# EAGLE design smps v.1.1 (EAGLE 7.3.0)
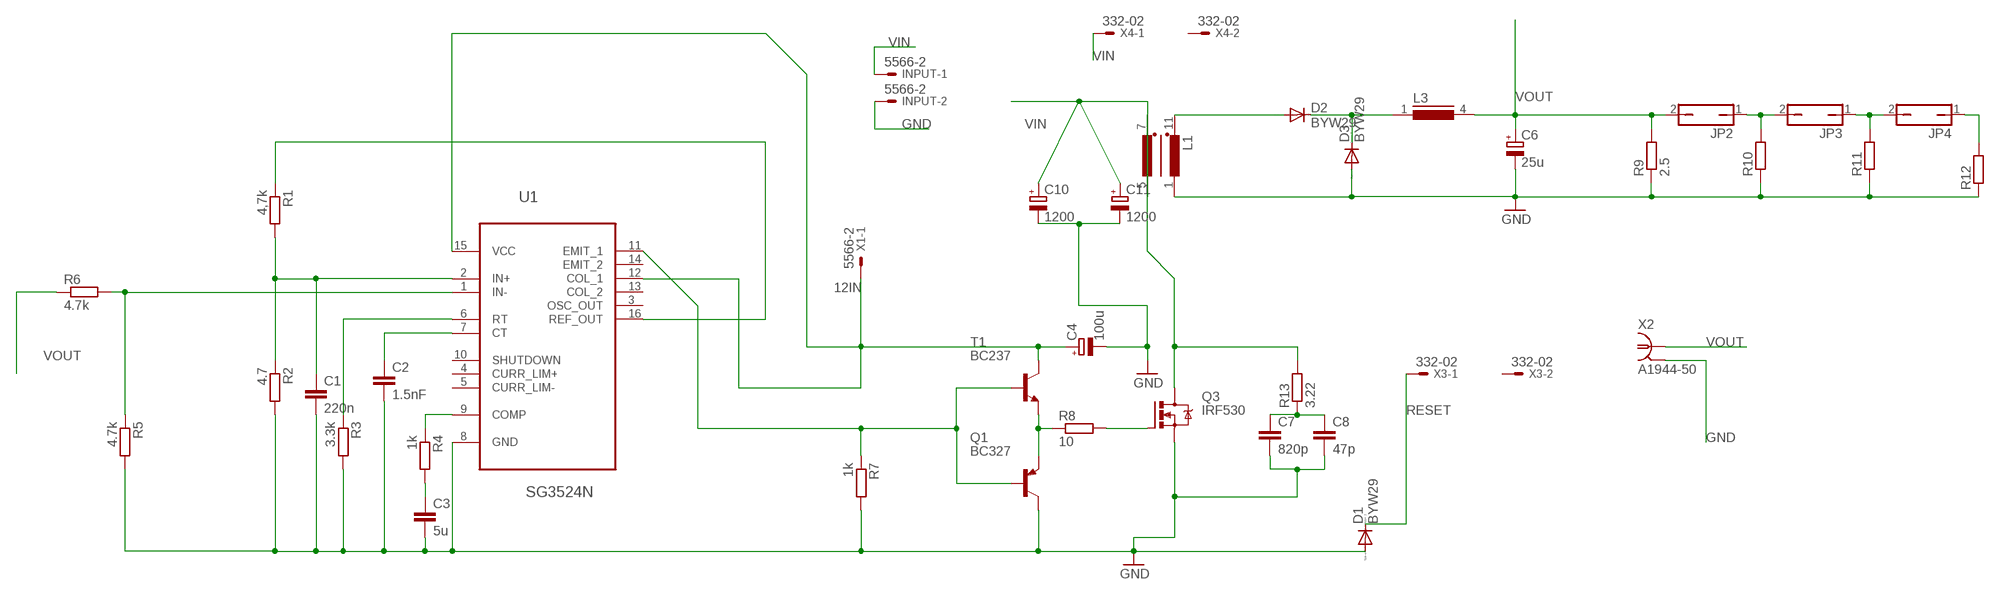
[diagram p0: schematic, sheet 1]

## Parts
C1  220n  C-EU050-030X075  [C050-030X075]
C2  1.5nF  C-EU050-035X075  [C050-035X075]
C3  5u  C-EU050-035X075  [C050-035X075]
C4  100u  CPOL-EUE2-4  [E2-4]
C6  25u  CPOL-EUE2-4  [E2-4]
C7  820p  C-EU025-025X050  [C025-025X050]
C8  47p  C-EU025-025X050  [C025-025X050]
C10  1200  CPOL-EUE7.5-16  [E7,5-16]
C11  1200  CPOL-EUE7.5-16  [E7,5-16]
D1  BYW29  [DO220S]
D2  BYW29  [DO220S]
D3  BYW29  [DO220S]
INPUT  5566-2  [5566-2]
JP2  JP1Q  [JP1]
JP3  JP1Q  [JP1]
JP4  JP1Q  [JP1]
L1  RM6-2RM812  [RM8-12]
L3  RM6NEWVARIANT  [RM7-8]
Q1  BC327  [TO92]
Q3  IRF530  [TO220BV]
R1  4,7k  R-EU_0204/7  [0204/7]
R2  4.7  R-EU_0204/7  [0204/7]
R3  3.3k  R-EU_0204/7  [0204/7]
R4  1k  R-EU_0204/7  [0204/7]
R5  4.7k  R-EU_0204/7  [0204/7]
R6  4.7k  R-EU_0204/7  [0204/7]
R7  1k  R-EU_0204/7  [0204/7]
R8  10  R-EU_0204/7  [0204/7]
R9  2.5  R-EU_0617/5V  [0617V]
R10  R-EU_0617/5V  [0617V]
R11  R-EU_0617/5V  [0617V]
R12  R-EU_0617/5V  [0617V]
R13  3.22  R-EU_0204/2V  [0204V]
T1  BC237  [TO92]
U1  SG3524N  [DIP254P762X508-16]
X1  5566-2  [5566-2]
X2  A1944-50  [A1944]
X3  332-02  [332-02]
X4  332-02  [332-02]

## Nets
12IN: C4.+ T1.3(C) U1.12(COL_1) U1.15(VCC) X1.1
GND: C1.2 C2.2 C3.2 C4.- C6.- C7.2 C8.2 C10.- C11.- D1.A D3.A INPUT.2 L1.1(W1E) Q1.3(C) Q3.S R2.2 R3.2 R5.2 R7.2 R9.1 R10.1 R11.1 R12.1 U1.8(GND) X2.2 X2.3 X2.4 X2.5
N$1: R1.1 U1.16(REF_OUT)
N$2: C1.1 R1.2 R2.1 U1.2(IN+)
N$3: Q1.2(B) R7.1 T1.2(B) U1.11(EMIT_1)
N$5: R3.1 U1.6(RT)
N$6: C2.1 U1.7(CT)
N$7: R4.1 U1.9(COMP)
N$8: C3.1 R4.2
N$9: R5.1 R6.2 U1.1(IN-)
N$10: Q1.1(E) R8.1 T1.1(E)
N$11: D2.A L1.11(W1A)
N$12: Q3.G R8.2
N$13: D2.C D3.C L3.1
N$14: L1.7(W2A) Q3.D R13.2
N$15: JP2.1 JP3.2 R10.2
N$16: JP3.1 JP4.2 R11.2
N$17: JP4.1 R12.2
N$18: C7.1 C8.1 R13.1
RESET: D1.C X3.1
VIN: C10.+ C11.+ INPUT.1 L1.5(W2E) X4.1
VOUT: C6.+ JP2.2 L3.4 R6.1 R9.2 X2.1
Unconnected: U1.3(OSC_OUT) U1.4(CURR_LIM+) U1.5(CURR_LIM-) U1.10(SHUTDOWN) U1.13(COL_2) U1.14(EMIT_2) X1.2 X3.2 X4.2

## Library data of the parts
C1 = resistor:C-EU: CAPACITOR, European symbol
C2 C3 C7 C8 = rcl:C-EU: CAPACITOR, European symbol
C4 C6 C10 C11 = rcl:CPOL-EU: POLARIZED CAPACITOR, European symbol
D1-D3 = diode:BYW29: DIODE ultra fast rectifier, 200 V, 8 A
INPUT X1 = con-molex:5566-2: Mini FIT connector 2 pol Source: http://www.molex.com; OC_FARNELL: 1822072; OC_NEWARK: unknown
JP2-JP4 = jumper:JP1Q: JUMPER
L1 = trafo-siemens:RM6-2: TRANSFORMER
L3 = trafo-siemens:RM6: INDUCTOR
Q1 = transistor-pnp:BC327: PNP Transistor
Q3 = transistor-power:IRF530: HEXFET Power MOSFET
R1-R8 = resistor:R-EU_: RESISTOR, European symbol
R9-R13 = rcl:R-EU_: RESISTOR, European symbol
T1 = transistor:BC237: NPN TRANSISTOR
U1 = Texas Instruments_By_element14_Batch_1:SG3524N: REGULATING PULSE-WIDTH-MODULATORS; MPN: SG3524N; OC_FARNELL: 1094322; OC_NEWARK: 60K6778; PACKAGE: PDIP-16; SUPPLIER: Texas Instruments
X2 = con-coax:A1944-50: BNC CONNECTOR 50 Ohm distributor Buerklin 78F2475; OC_FARNELL: unknown; OC_NEWARK: unknown
X3 X4 = con-garry:332-02: 2 Pin - 2mm Dual Row Source: www.mpe-connector.de / garry_shortform_2012.pdf

## Board
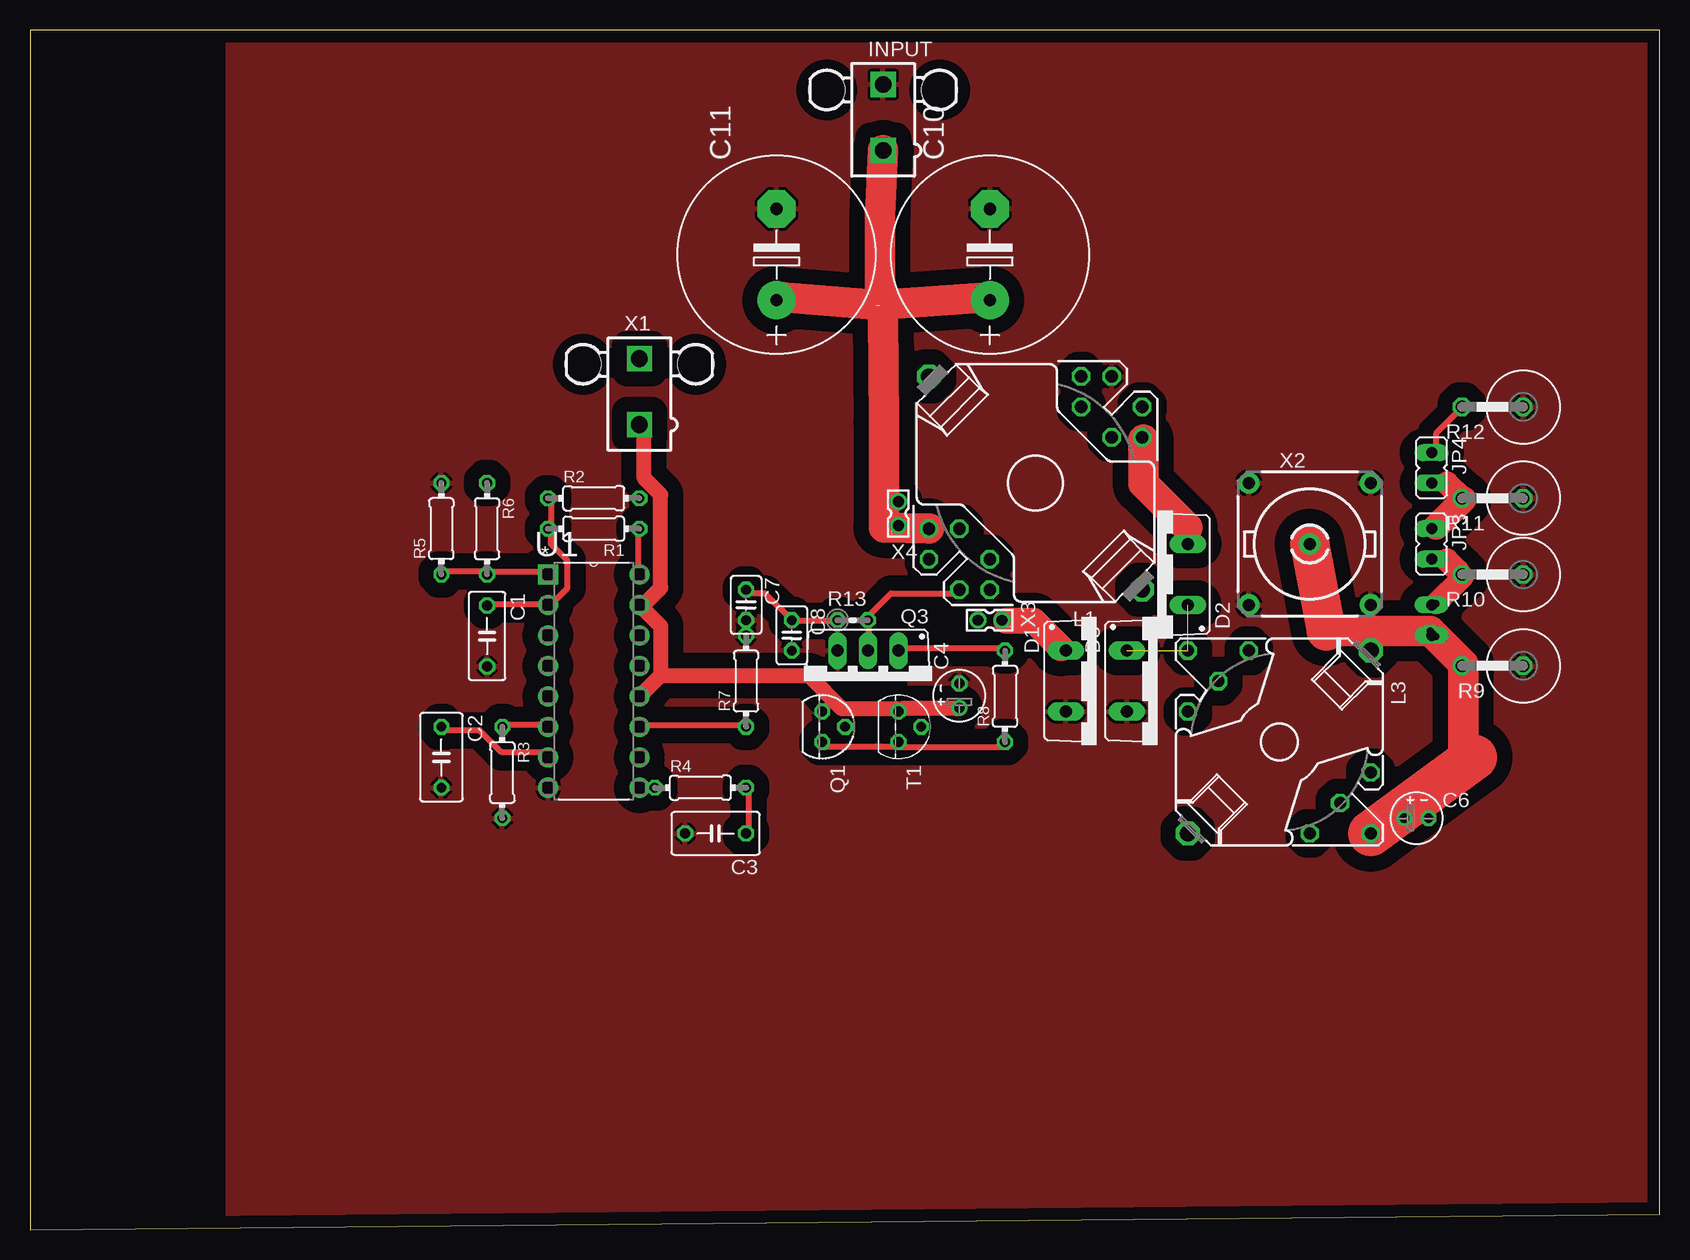
[diagram p1: board, top side]
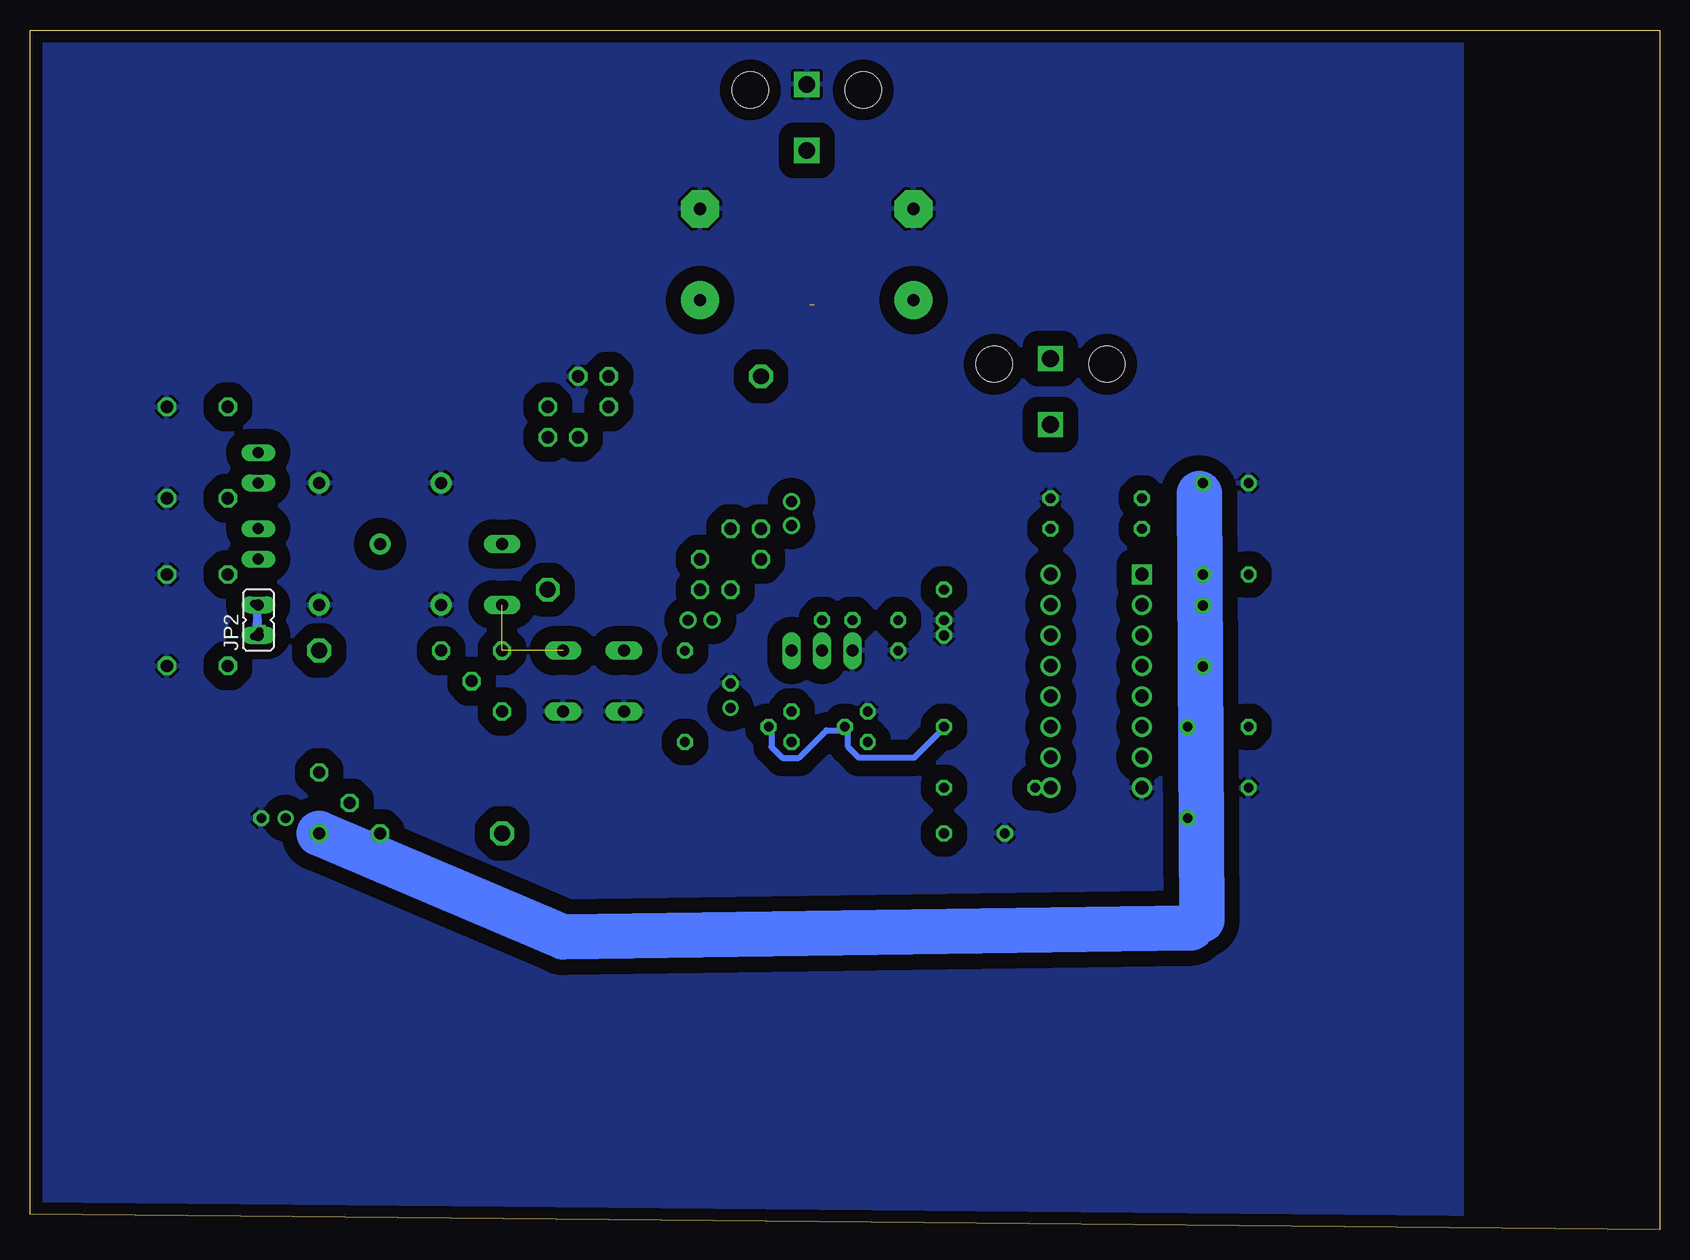
[diagram p2: board, bottom side, seen from below]

Size 135.87 x 100 mm. Coordinates in mm from the lower left corner, seen from the top.
Outline: 0,0 135.87,1.27 135.87,100 0,100 0,0
Copper layers (1*16): Top 0.035mm / dielectric 1.5mm / Bottom 0.035mm
Design rules "default *": minimum track width 20mil, minimum drill 24mil, track to track 50mil, track to pad 50mil, pad to pad 50mil, via to via 50mil, smd to smd 8mil, copper to edge 40mil, drill to drill 8mil, minimum pad ring 10mil, minimum via ring 8mil, stop-mask expansion 4mil, vias tented up to drill 0mil, thermal gap 10mil

### Footprints (pad centres in the part's own frame; a part is rotated, then mirrored left to right if it is on the bottom)
C050-030X075 = drill 0.813 octagon: 1 -2.54,0; 2 2.54,0
C050-035X075 = drill 0.813 octagon: 1 -2.54,0; 2 2.54,0
E2-4 = drill 0.813 pad 1.27: + -1.016,0 | drill 0.813 pad 1.27 octagon: - 1.016,0
C025-025X050 = drill 0.813 octagon: 1 -1.27,0; 2 1.27,0
E7,5-16 = drill 1.016 pad 3.15: + -3.81,0 | drill 1.016 pad 3.15 octagon: - 3.81,0
DO220S = drill 1.016 long: A 2.54,-2.54; C -2.54,-2.54
5566-2 = drill 1.4 square: 1 0,-2.75; 2 0,2.75 | hole 3: 4.7,2.29; -4.7,2.29
JP1 = drill 0.914 long: 1 0,-1.27; 2 0,1.27
RM8-12 = drill 1.016 octagon: 1 8.89,-6.35; 2 8.89,-3.81; 3 6.35,-3.81; 4 -3.81,6.35; 5 -3.81,8.89; 6 -6.35,8.89; 7 -8.89,6.35; 8 -8.89,3.81; 9 -6.35,3.81; 10 3.81,-6.35; 11 3.81,-8.89; 12 6.35,-8.89 | drill 1.321 octagon: M -8.89,-8.89; M1 8.89,8.89
RM7-8 = drill 1.016 octagon: 1 7.62,-7.62; 2 7.62,-2.54; 3 -2.54,7.62; 4 -7.62,7.62; 5 -7.62,2.54; 6 -5.08,5.08; 7 2.54,-7.62; 8 5.08,-5.08 | drill 1.321 octagon: M -7.62,-7.62; M1 7.62,7.62
TO92 = drill 0.813 octagon: 1 1.27,0; 2 0,1.905; 3 -1.27,0
TO220BV = drill 1.016 long: D 0,-2.54; G -2.54,-2.54; S 2.54,-2.54
0204/7 = drill 0.813 octagon: 1 -3.81,0; 2 3.81,0
0617V = drill 1.016 octagon: 1 -2.54,0; 2 2.54,0
0204V = drill 0.813 octagon: 1 -1.27,0; 2 1.27,0
DIP254P762X508-16 = drill 1.118 square: 1 -7.62,17.78 | drill 1.118: 2 -7.62,15.24; 3 -7.62,12.7; 4 -7.62,10.16; 5 -7.62,7.62; 6 -7.62,5.08; 7 -7.62,2.54; 8 -7.62,0; 9 0,0; 10 0,2.54; 11 0,5.08; 12 0,7.62; 13 0,10.16; 14 0,12.7; 15 0,15.24; 16 0,17.78
A1944 = drill 1.016 pad 1.778: 1 0,0; 2 5.08,5.08; 3 -5.08,5.08; 4 -5.08,-5.08; 5 5.08,-5.08
332-02 = drill 0.9 pad 1.27: 1 0,-1; 2 0,1

### Placement (x,y rotation side)
C1  38.1,49.48 270 top
C2  34.29,39.37 270 top
C3  57.15,33.02 180 top
C4  77.47,44.5 90 top
C6  115.57,34.29 0 top
C7  59.69,52.07 270 top
C8  63.5,49.53 270 top
C10  80.01,81.28 90 top
C11  62.23,81.28 90 top
D1  88.9,45.72 270 top
D2  93.98,54.61 90 top
D3  93.98,45.72 270 top
INPUT  71.12,92.71 0 top
JP2  116.84,50.8 0 bottom
JP3  116.84,57.15 180 top
JP4  116.84,63.5 180 top
L1  83.82,62.23 90 top
L3  104.14,40.64 180 top
Q1  66.04,41.91 270 top
Q3  69.85,45.72 180 top
R1  46.99,58.42 180 top
R2  46.99,60.96 0 top
R3  39.37,38.1 270 top
R4  55.88,36.83 0 top
R5  34.29,58.42 90 top
R6  38.1,58.42 270 top
R7  59.69,45.72 90 top
R8  81.28,44.45 90 top
R9  121.92,46.99 180 top
R10  121.92,54.61 180 top
R11  121.92,60.96 180 top
R12  121.92,68.58 180 top
R13  68.58,50.8 0 top
T1  72.39,41.91 270 top
U1  50.8,36.83 0 top
X1  50.8,69.85 0 top
X2  106.68,57.15 0 top
X3  80.01,50.8 90 top
X4  72.39,59.69 0 top

### Tracks (layer width: path | path; a pad name or v marks a point on that pad's centre or on a via)
12IN
  Top 0.508: 72.69,43.43 T1.3 72.24,43.43 | 77.27,43.43 C4.+ | 51.21,44.81 U1.12 | 51.21,66.75 X1.1 | 51.21,52.12 U1.15
  Top 1.27: 77.27,43.43 72.69,43.43 | 52.58,46.18 51.21,44.81 | 52.58,46.18 52.58,50.29 U1.15 | 51.21,66.75 51.21,62.64 52.58,61.27 52.58,53.49 51.21,52.12 | 72.24,43.43 67.67,43.43 64.92,46.18 52.58,46.18
GND
  pour Bottom: 16.51,100.33 135.89,100.33 135.89,1.27 16.51,0
  pour Top: 16.51,100.33 135.89,100.33 135.89,1.27 16.51,0
N$1
  Top 0.508: R1.1 50.75,58.06 50.75,54.86 U1.16
N$2
  Top 0.508: R2.1 43.43,60.81 43.43,58.52 R1.2 43.43,58.06 43.43,57.15 44.81,55.78 44.81,53.49 43.43,52.12 U1.2 42.98,52.12 38.41,52.12 C1.1
N$3
  Top 0.508: R7.1 59.44,42.06 51.21,42.06 U1.11
  Bottom 0.508: T1.2 74.07,41.6 74.07,40.23 73.15,39.32 71.78,39.32 69.49,41.6 68.12,41.6 Q1.2 67.67,41.6 67.67,40.23 66.75,39.32 62.18,39.32 59.89,41.6 R7.1
N$5
  Top 0.508: R3.1 39.78,42.06 42.98,42.06 U1.6
N$6
  Top 0.508: C2.1 34.29,41.6 37.49,41.6 39.32,39.78 42.98,39.78 U1.7
N$7
  Top 0.508: R4.1 51.66,37.03 51.21,37.03 U1.9
N$8
  Top 0.508: C3.1 59.89,33.38 59.89,36.58 R4.2
N$9
  Top 0.508: R5.1 34.29,54.86 37.95,54.86 R6.2 38.41,54.86 42.98,54.86 U1.1
N$10
  Top 0.508: Q1.1 66.29,40.23 72.24,40.23 T1.1 72.69,40.23 80.92,40.23 R8.1
N$11
  Top 0.508: 92.81,65.84 L1.11 | 96.47,58.52 D2.A
  Top 2.54: 92.81,65.84 92.81,62.18 96.47,58.52
N$12
  Top 0.508: R8.2 80.92,48.46 72.69,48.46 Q3.G
N$13  (2 unrouted)
N$14
  Top 0.508: Q3.D 69.95,48.46 69.95,50.75 R13.2 69.95,51.21 71.78,53.03 77.27,53.03 L1.7
N$15  (via drill 0.6)
  Top 0.508: 119.48,54.46 R10.2 119.02,54.91 | 118.11,55.83 117.2,55.83 JP3.2
  Top 1.778: 119.48,54.46 v117.2,52.17
  Top 1.93: 119.02,54.91 118.11,55.83
  Bottom 0.508: v117.2,52.17 JP2.1
N$16
  Top 0.508: 117.2,58.57 JP3.1 | 119.48,60.86 R11.2 | 118.11,62.23 JP4.2
  Top 1.93: R11.2 118.11,62.23
  Top 2.184: 119.48,60.86 117.2,58.57
N$17
  Top 0.508: JP4.1 117.2,64.97 117.2,66.34 119.02,68.17 R12.2
N$18
  Top 0.508: R13.1 67.21,50.75 63.55,50.75 C8.1 61.27,53.03 59.89,53.03 C7.1
RESET
  Top 0.508: 81.38,50.75 X3.1 | 85.95,48.46 D1.C
  Top 2.184: 81.38,50.75 83.67,50.75 85.95,48.46
VIN  (1 unrouted)
  Top 0.508: 62.64,77.72 C11.+ | X4.1 72.69,58.52 74.52,58.52 L1.5 | 71.12,76.15 C10.+ 80.01,77.72
  Top 2.54: 62.64,77.72 70.87,77.06 70.87,84.53 INPUT.1 | 71.12,76.15 71.17,67.31 71.17,58.52 L1.5 | 80.01,77.72 70.51,77.06
VOUT  (via drill 0.6)
  Top 0.508: 119.48,47.14 R9.2 119.48,46.69 | 120.4,39.37 119.48,40.28
  Top 2.54: 119.48,47.14 v117.2,49.43 | v116.74,49.89 108.05,49.89 | L3.4 C6.+ | 119.48,40.28 119.48,46.69
  Top 3.302: 108.05,49.89 X2.1
  Top 3.81: 120.4,39.37 L3.4
  Bottom 0.508: v117.2,49.43 JP2.2 v116.74,49.89 | 38.41,61.37 R6.1
  Bottom 2.54: 39.12,25.15 38.2,25.81
  Bottom 3.81: 38.2,25.81 38.41,61.37 | 39.12,25.15 91.44,24.38 L3.4